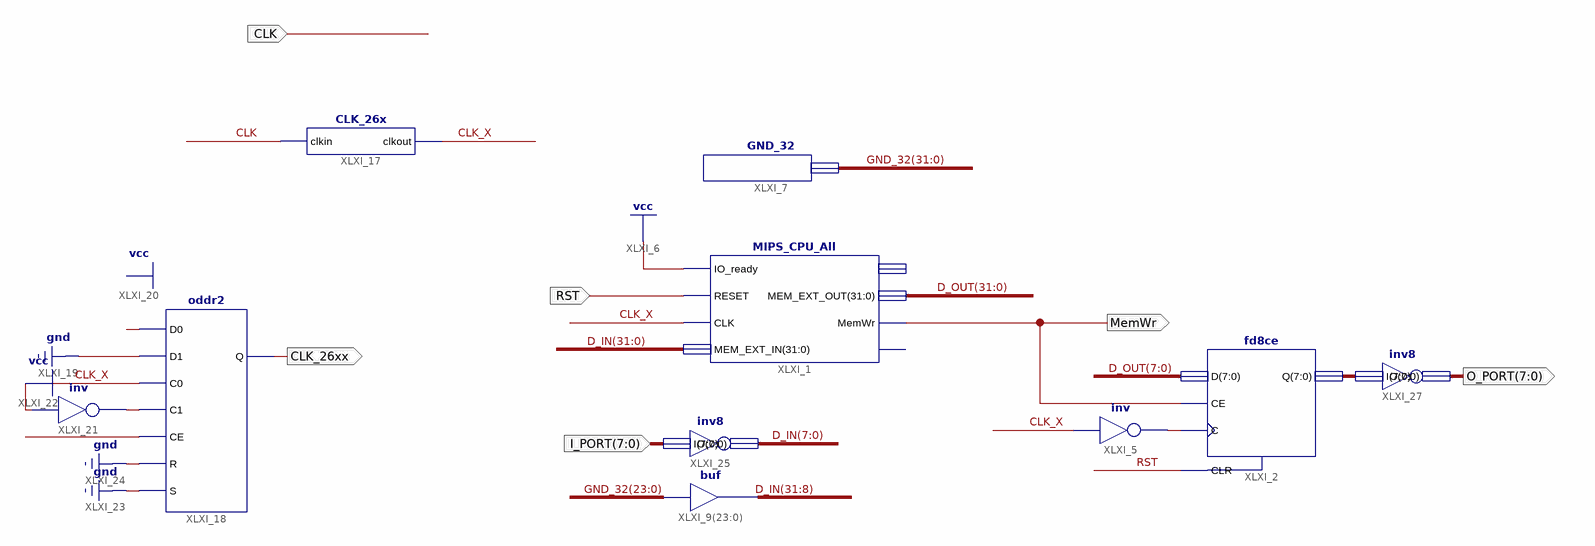
[diagram p0: schematic sheet 1]
// Xilinx ISE schematic CPU_LED_Driver.sch (spartan6) as structural Verilog: 10 symbols, 6 ports
module CPU_LED_Driver (
  input  RST,
  input  [7:0] I_PORT,
  input  CLK,
  output MemWr,
  output CLK_26xx,
  output [7:0] O_PORT
);

  wire CLK_X, XLXN_13, XLXN_42;
  wire [7:0] XLXN_52;
  wire [31:0] D_IN, D_OUT, GND_32;

  MIPS_CPU_All XLXI_1 (
    .CLK(CLK_X), .IO_ready(1'b1), .MemWr(MemWr), .MEM_EXT_IN(D_IN), .MEM_EXT_OUT(D_OUT), .RESET(RST));  // open: MEM_EXT_ADDR, On_IO
  fd8ce XLXI_2 (.C(XLXN_13), .CE(MemWr), .CLR(RST), .D(D_OUT[7:0]), .Q(XLXN_52));
  not XLXI_5 (XLXN_13, CLK_X);
  GND_32 XLXI_7 (.GND_OUT(GND_32));
  assign D_IN[31:8] = GND_32[23:0];  // buf XLXI_9[23..0], 24 bits wide
  CLK_26x XLXI_17 (.clkin(CLK), .clkout(CLK_X));
  oddr2 XLXI_18 (.D0(1'b1), .D1(1'b0), .C0(CLK_X), .C1(XLXN_42), .CE(1'b1), .R(1'b0), .Q(CLK_26xx), .S(1'b0));
  not XLXI_21 (XLXN_42, CLK_X);
  inv8 XLXI_25 (.I(I_PORT), .O(D_IN[7:0]));
  inv8 XLXI_27 (.I(XLXN_52), .O(O_PORT));
endmodule
